# Altium project LimeSDR-Micro_mPCIe_1v3.PrjPcb (part 7 of 10)

## Sheet 10_Clock.SchDoc: Clock
size A3; Organization: Lime Microsystems; Address1: Surrey Tech Centre; Address2: Guildford GU2 7YG; Address3: Surrey; Address4: United Kingdom; Revision: 1.3; SheetNumber: 10; SheetTotal: 11
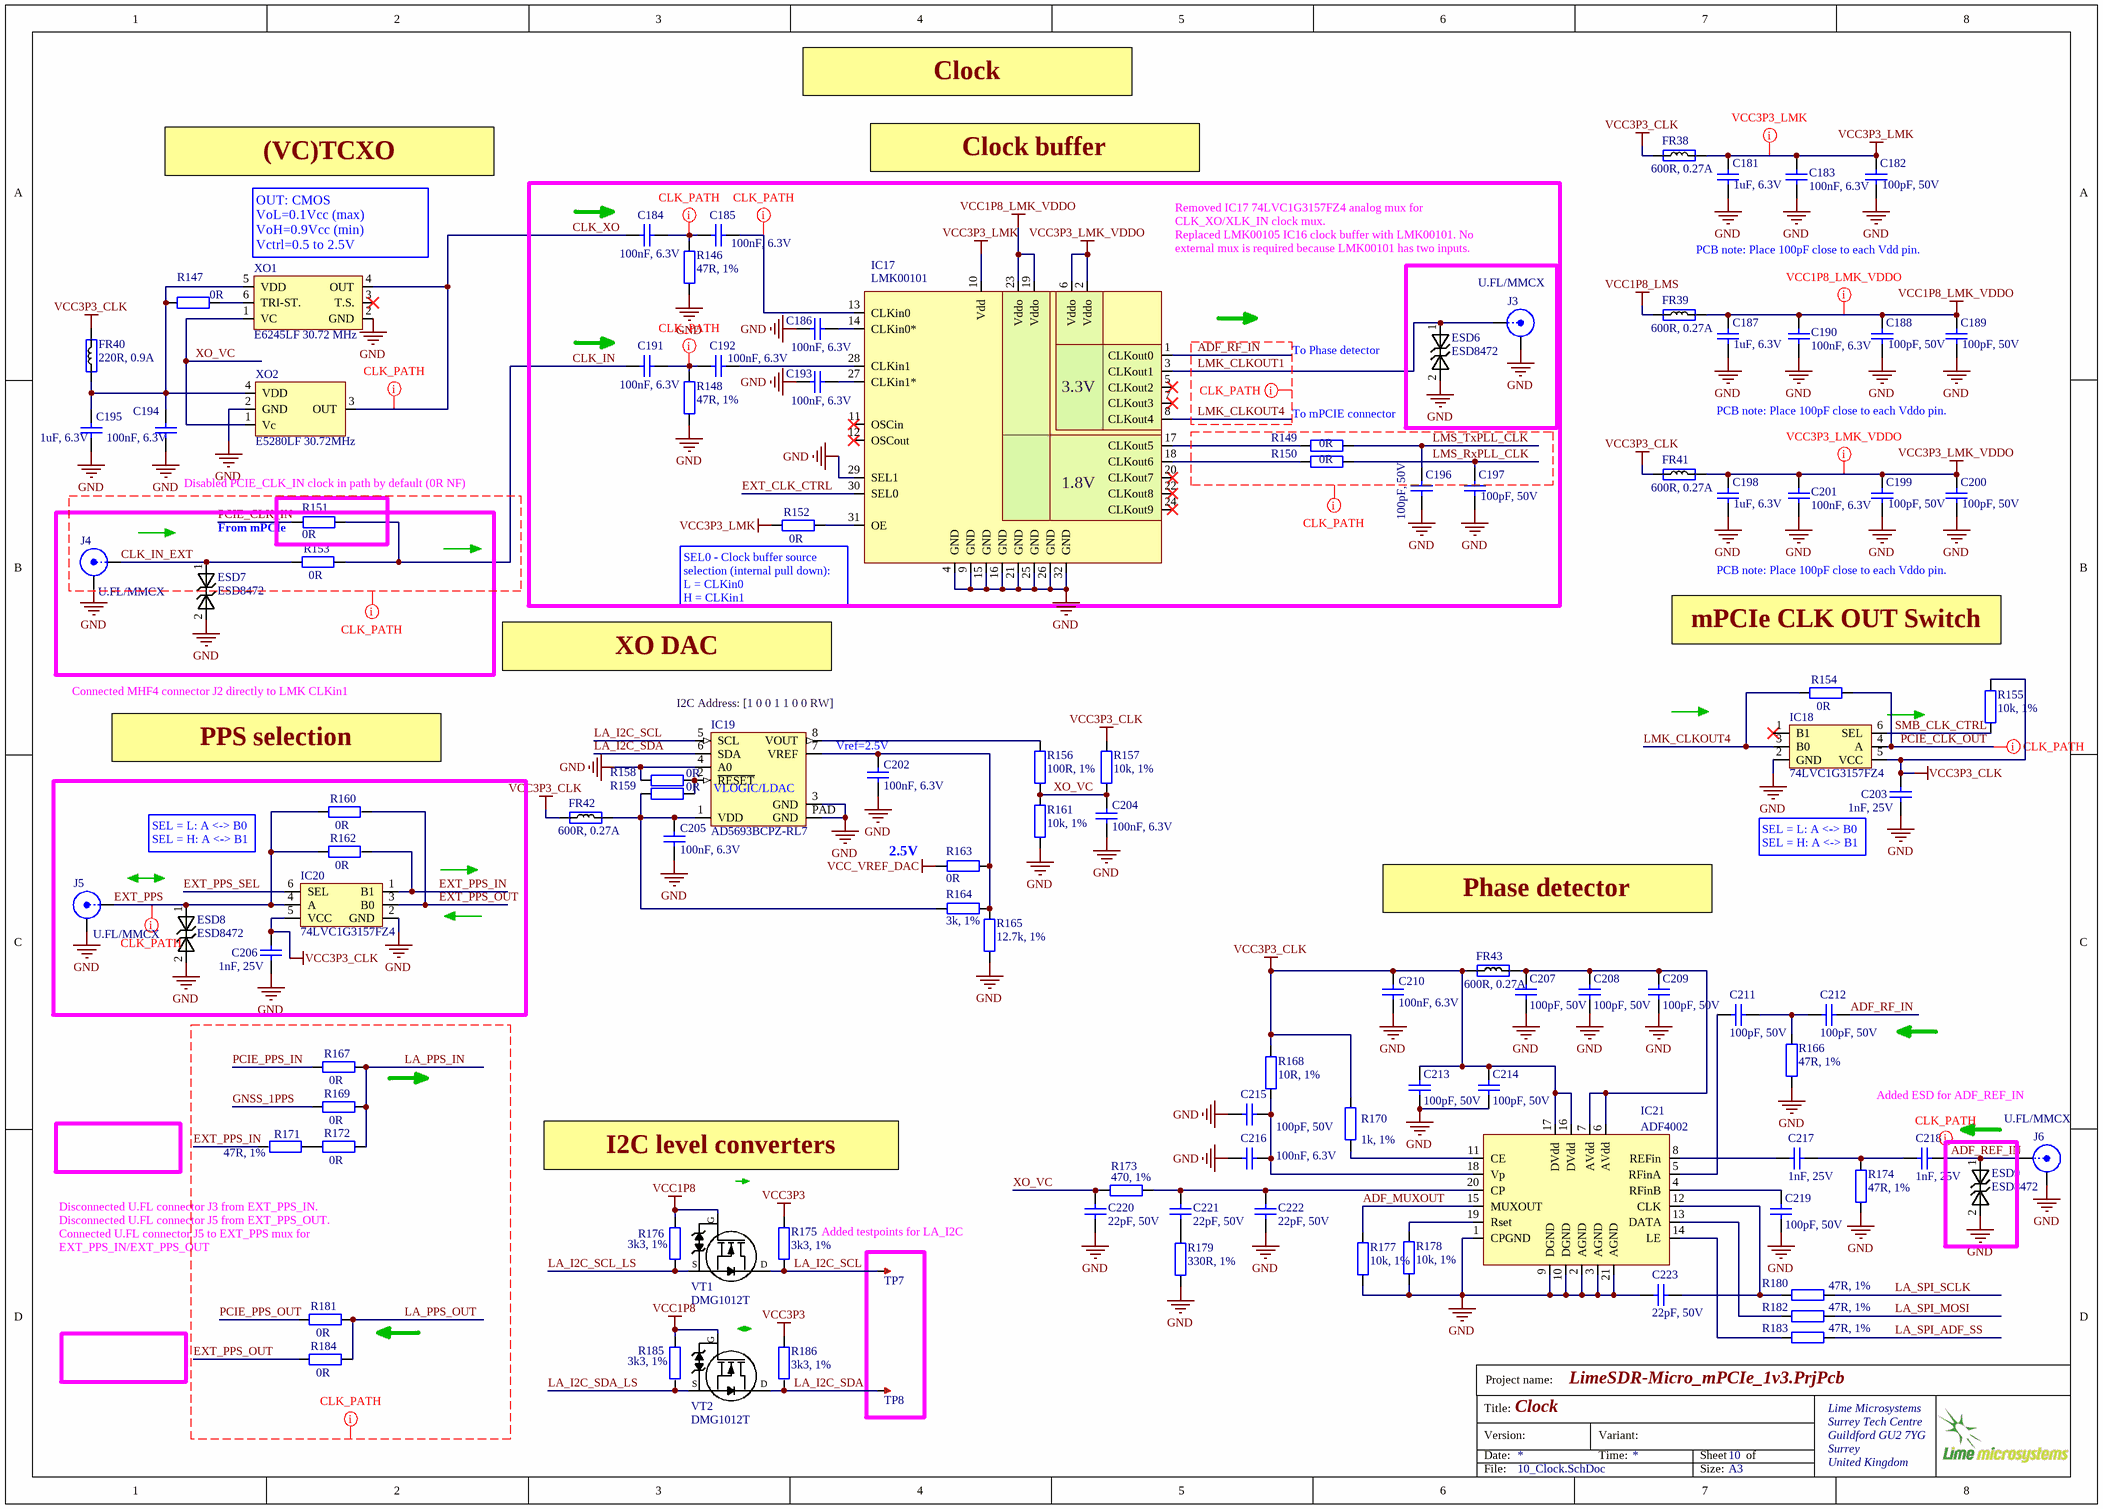
[diagram p9: 10_Clock.SchDoc]

### Parts
C181  1uF, 6.3V  [CAP0201]
C182  100pF, 50V  [CAP0201]
C183  100nF, 6.3V  [CAP0201]
C184  100nF, 6.3V  [CAP0201]
C185  100nF, 6.3V  [CAP0201]
C186  100nF, 6.3V  [CAP0201]
C187  1uF, 6.3V  [CAP0201]
C188  100pF, 50V  [CAP0201]
C189  100pF, 50V  [CAP0201]
C190  100nF, 6.3V  [CAP0201]
C191  100nF, 6.3V  [CAP0201]
C192  100nF, 6.3V  [CAP0201]
C193  100nF, 6.3V  [CAP0201]
C194  100nF, 6.3V  [CAP0201]
C195  1uF, 6.3V  [CAP0201]
C196  100pF, 50V  [CAP0201]
C197  100pF, 50V  [CAP0201]
C198  1uF, 6.3V  [CAP0201]
C199  100pF, 50V  [CAP0201]
C200  100pF, 50V  [CAP0201]
C201  100nF, 6.3V  [CAP0201]
C202  100nF, 6.3V  [CAP0201]
C203  1nF, 25V  [CAP0201]
C204  100nF, 6.3V  [CAP0201]
C205  100nF, 6.3V  [CAP0201]
C206  1nF, 25V  [CAP0201]
C207  100pF, 50V  [CAP0201]
C208  100pF, 50V  [CAP0201]
C209  100pF, 50V  [CAP0201]
C210  100nF, 6.3V  [CAP0201]
C211  100pF, 50V  [CAP0201]
C212  100pF, 50V  [CAP0201]
C213  100pF, 50V  [CAP0201]
C214  100pF, 50V  [CAP0201]
C215  100pF, 50V  [CAP0201]
C216  100nF, 6.3V  [CAP0201]
C217  1nF, 25V  [CAP0201]
C218  1nF, 25V  [CAP0201]
C219  100pF, 50V  [CAP0201]
C220  22pF, 50V  [CAP0201]
C221  22pF, 50V  [CAP0201]
C222  22pF, 50V  [CAP0201]
C223  22pF, 50V  [CAP0201]
ESD6  ESD8472  [ESD8472_X3DFN2]
ESD7  ESD8472  [ESD8472_X3DFN2]
ESD8  ESD8472  [ESD8472_X3DFN2]
ESD9  ESD8472  [ESD8472_X3DFN2]
FR38  600R, 0.27A  [RES0201]
FR39  600R, 0.27A  [RES0201]
FR40  220R, 0.9A  [RES0402]
FR41  600R, 0.27A  [RES0201]
FR42  600R, 0.27A  [RES0201]
FR43  600R, 0.27A  [RES0201]
IC17  LMK00101  [LMK00101_WQFN32]
IC18  74LVC1G3157FZ4  [74LVC1G3157FZ4_SPDT_SW_DFN1410-6]
IC19  AD5693BCPZ-RL7  [AD5693RACPZ-1RL7_DAC_8LFCSP]
IC20  74LVC1G3157FZ4  [74LVC1G3157FZ4_SPDT_SW_DFN1410-6]
IC21  ADF4002  [ADF4002]
J3  U.FL/MMCX  [MMCX_UFL_conn_u_v2]
J4  U.FL/MMCX  [MMCX_UFL_conn_u_v2]
J5  U.FL/MMCX  [MMCX_UFL_conn_u_v2]
J6  U.FL/MMCX  [MMCX_UFL_conn_u_v2]
R146  47R, 1%  [RES0201]
R147  0R  [RES0402]
R148  47R, 1%  [RES0201]
R149  0R  [RES0201]
R150  0R  [RES0201]
R151  0R  [RES0201]
R152  0R  [RES0201]
R153  0R  [RES0201]
R154  0R  [RES0201]
R155  10k, 1%  [RES0201]
R156  100R, 1%  [RES0201]
R157  10k, 1%  [RES0201]
R158  0R  [RES0201]
R159  0R  [RES0201]
R160  0R  [RES0201]
R161  10k, 1%  [RES0201]
R162  0R  [RES0201]
R163  0R  [RES0201]
R164  3k, 1%  [RES0201]
R165  12.7k, 1%  [RES0201]
R166  47R, 1%  [RES0201]
R167  0R  [RES0201]
R168  10R, 1%  [RES0201]
R169  0R  [RES0201]
R170  1k, 1%  [RES0201]
R171  47R, 1%  [RES0201]
R172  0R  [RES0201]
R173  470, 1%  [RES0201]
R174  47R, 1%  [RES0201]
R175  3k3, 1%  [RES0201]
R176  3k3, 1%  [RES0201]
R177  10k, 1%  [RES0201]
R178  10k, 1%  [RES0201]
R179  330R, 1%  [RES0201]
R180  47R, 1%  [RES0201]
R181  0R  [RES0201]
R182  47R, 1%  [RES0201]
R183  47R, 1%  [RES0201]
R184  0R  [RES0201]
R185  3k3, 1%  [RES0201]
R186  3k3, 1%  [RES0201]
TP7  TESTPOINT_PAD  [TP_PAD_1MM]  (value not drawn)  (no BOM)
TP8  TESTPOINT_PAD  [TP_PAD_1MM]  (value not drawn)  (no BOM)
VT1  DMG1012T  [SOT523]
VT2  DMG1012T  [SOT523]
XO1  E6245LF 30.72 MHz  [RAKON_RPT7050A]
XO2  E5280LF 30.72MHz  [RAKON_TXCO]

### Blocks framed on the sheet
From mPCIe: ESD7 J4 R151 R153

### Nets
GND: C181.2 C182.1 C183.1 C186.1 C187.2 C188.1 C189.1 C190.1 C193.1 C194.2 C195.2 C196.1 C197.1 C198.2 C199.1 C200.1 C201.1 C202.2 C203.1 C204.2 C205.2 C206.1 C207.1 C208.1 C209.1 C210.2 C213.1 C214.1 C215.2 C216.1 C219.1 C220.1 C222.1 C223.2 ESD6.2 ESD7.2 ESD8.2 ESD9.2 IC17.4(GND) IC17.9(GND) IC17.15(GND) IC17.16(GND) IC17.21(GND) IC17.25(GND) IC17.26(GND) IC17.29(SEL1) IC17.32(GND) IC18.2(GND) IC19.3(GND) IC19.4(A0) IC19.PAD(GND) IC20.2(GND) IC21.1(CPGND) IC21.2(AGND) IC21.3(AGND) IC21.9(DGND) IC21.10(DGND) IC21.21(AGND) J3.2(Y) J4.2(Y) J5.2(Y) J6.2(Y) R146.2 R148.2 R158.1 R161.2 R165.2 R166.2 R174.1 R177.2 R178.2 R179.2 XO1.2(GND) XO2.2(GND)
VCC1P8: R176.1 R185.1 VT1.G VT2.G
VCC1P8_LMK_VDDO: C187.1 C188.2 C189.2 C190.2 FR39.2 IC17.19(Vddo) IC17.23(Vddo)
VCC1P8_LMS: FR39.1
VCC3P3: R175.1 R186.1
VCC3P3_CLK: C203.2 C206.2 C210.1 C213.2 C214.2 FR38.1 FR40.2 FR41.1 FR42.1 FR43.1 IC18.5(VCC) IC20.5(VCC) IC21.16(DVdd) IC21.17(DVdd) R155.2 R157.1 R168.2 R170.1
VCC3P3_LMK: C181.1 C182.2 C183.2 FR38.2 IC17.10(Vdd) R152.1
VCC3P3_LMK_VDDO: C198.1 C199.2 C200.2 C201.2 FR41.2 IC17.2(Vddo) IC17.6(Vddo)
VCC_VREF_DAC: R163.2
ADF_MUXOUT: IC21.15(MUXOUT) R177.1
ADF_REF_IN: C218.2 ESD9.1 J6.1(X)
ADF_RF_IN: C212.1 IC17.1(CLKout0)
CLK_IN: C191.2 R151.1 R153.2
CLK_IN_EXT: ESD7.1 J4.1(X) R153.1
CLK_XO: C184.2 XO1.4(OUT) XO2.3(OUT)
EXT_CLK_CTRL: IC17.30(SEL0)
EXT_PPS: ESD8.1 IC20.4(A) J5.1(X) R160.1 R162.1
EXT_PPS_IN: IC20.1(B1) R162.2 R171.2
EXT_PPS_OUT: IC20.3(B0) R160.2 R184.1
EXT_PPS_SEL: IC20.6(SEL)
GNSS_1PPS: R169.1
LA_I2C_SCL: IC19.5(SCL) R175.2 TP7.1 VT1.D
LA_I2C_SCL_LS: R176.2 VT1.S
LA_I2C_SDA: IC19.6(SDA) R186.2 TP8.1 VT2.D
LA_I2C_SDA_LS: R185.2 VT2.S
LA_PPS_IN: R167.2 R169.2 R172.2
LA_PPS_OUT: R181.2 R184.2
LA_SPI_ADF_SS: R183.2
LA_SPI_MOSI: R182.2
LA_SPI_SCLK: R180.2
LMK_CLKOUT1: ESD6.1 IC17.3(CLKout1) J3.1(X)
LMK_CLKOUT4: IC17.8(CLKout4) IC18.3(B0) R154.1
LMS_RxPLL_CLK: C197.2 R150.2
LMS_TxPLL_CLK: C196.2 R149.2
PCIE_CLK_IN: R151.2
PCIE_CLK_OUT: IC18.4(A) R154.2
PCIE_PPS_IN: R167.1
PCIE_PPS_OUT: R181.1
SMB_CLK_CTRL: IC18.6(SEL) R155.1
XO_VC: C204.1 C220.2 R156.2 R157.2 R161.1 R173.1 XO1.1(VC) XO2.1(Vc)
NetC184_1: C184.1 C185.1 R146.1
NetC185_2: C185.2 IC17.13(CLKin0)
NetC186_2: C186.2 IC17.14(CLKin0*)
NetC191_1: C191.1 C192.1 R148.1
NetC192_2: C192.2 IC17.28(CLKin1)
NetC193_2: C193.2 IC17.27(CLKin1*)
NetC194_1: C194.1 C195.1 FR40.1 R147.2 XO1.5(VDD) XO2.4(VDD)
NetC202_1: C202.1 IC19.7(VREF) R163.1 R164.1 R165.1
NetC205_1: C205.1 FR42.2 IC19.1(VDD) R159.1 R164.2
NetC207_2: C207.2 C208.2 C209.2 FR43.2 IC21.6(AVdd) IC21.7(AVdd)
NetC211_1: C211.1 C212.2 R166.1
NetC211_2: C211.2 IC21.5(RFinA)
NetC215_1: C215.1 C216.2 IC21.18(Vp) R168.1
NetC217_1: C217.1 IC21.8(REFin)
NetC217_2: C217.2 C218.1 R174.2
NetC219_2: C219.2 IC21.4(RFinB)
NetC221_1: C221.1 R179.1
NetC221_2: C221.2 C222.2 IC21.20(CP) R173.2
NetC223_1: C223.1 IC21.12(CLK) R180.1
NetIC17_17: IC17.17(CLKout5) R149.1
NetIC17_18: IC17.18(CLKout6) R150.1
NetIC17_31: IC17.31(OE) R152.2
NetIC19_2: IC19.2(~{RESET}) R158.2 R159.2
NetIC19_8: IC19.8(VOUT) R156.1
NetIC21_11: IC21.11(CE) R170.2
NetIC21_13: IC21.13(DATA) R182.1
NetIC21_14: IC21.14(LE) R183.1
NetIC21_19: IC21.19(Rset) R178.1
NetR147_1: R147.1 XO1.6(TRI-ST.)
NetR171_1: R171.1 R172.1

Not connected (* = marked no-connect by the designer): IC17 5(CLKout2)* 7(CLKout3)* 11(OSCin)* 12(OSCout)* 20(CLKout7)* 22(CLKout8)* 24(CLKout9)*; IC18 1(B1)*; XO1 3(T.S.)*

### Layout directives
net class CLK_PATH: ADF_REF_IN, ADF_RF_IN, CLK_IN_EXT, CLK_XO, EXT_PPS, EXT_PPS_IN, EXT_PPS_OUT, GND, GNSS_1PPS, LA_PPS_IN, LA_PPS_OUT, LMK_CLKOUT1, LMK_CLKOUT4, LMS_RxPLL_CLK, LMS_TxPLL_CLK, NetC184_1, NetC185_2, NetC191_1, PCIE_CLK_IN, PCIE_CLK_OUT, PCIE_PPS_IN, PCIE_PPS_OUT
net class VCC3P3_LMK: VCC3P3_LMK
net class VCC3P3_LMKRF: VCC1P8_LMK_VDDO
net class VCC3P3_LMK_VDDO: VCC3P3_LMK_VDDO

### Notes on the sheet
- Clock
- (VC)TCXO
- Clock buffer
- (near XO1) OUT: CMOS
  VoL=0.1Vcc (max)
  VoH=0.9Vcc (min)
  Vctrl=0.5 to 2.5V
- (near IC17) Removed IC17 74LVC1G3157FZ4 analog mux for CLK_XO/XLK_IN clock mux.
  Replaced LMK00105 IC16 clock buffer with LMK00101. No external mux is required because LMK00101 has two inputs.
  Connected U.FL connector J3 directly to LMK_CLKOUT1
- PCB note: Place 100pF close to each Vdd pin.
- (near ESD6) To Phase detector
- (near IC17) 3.3V
- To mPCIE connector
- PCB note: Place 100pF close to each Vddo pin.
- (near IC17) 1.8V
- (near R151) Disabled PCIE_CLK_IN clock in path by default (0R NF)
- SEL0 - Clock buffer source selection (internal pull down):
  L = CLKin0
  H = CLKin1
- mPCIe CLK OUT Switch
- XO DAC
- (near IC19) I2C Address: [1 0 0 1 1 0 0 RW]
- Connected MHF4 connector J2 directly to LMK CLKin1
- (near R160) PPS selection
- (near C202) Vref=2.5V
- SEL = L: A <-> B0
  SEL = H: A <-> B1
- (near IC19) VLOGIC/LDAC
- (near R163) 2.5V
- Phase detector
- I2C level converters
- Added ESD for ADF_REF_IN
- Disconnected U.FL connector J3 from EXT_PPS_IN.
  Disconnected U.FL connector J5 from EXT_PPS_OUT.
  Connected U.FL connector J5 to EXT_PPS mux for
  EXT_PPS_IN/EXT_PPS_OUT
- (near TP7) Added testpoints for LA_I2C
- Project name:
- Title:
- Version:
- Date:
- Variant:
- Time:
- Sheet
- of
- File:
- Size:
- A3

### Library data of the parts
C181 C187 C195 C198 = Cap_0402: Manufacturer: TDK Corporation; Manufacturer Part Number 1: JMK063ABJ105MP-F; Part Description: 1µF ±20% 6.3V X5R Ceramic Capacitor -55°C ~ 85°C Surface Mount, MLCC 0201 (0603 Metric) 0.024" L x 0.012" W (0.60mm x 0.30mm); Value: 1uF, 20%; Tolerance: ±20%; Capacitance: 1.0µF; Temperature Coefficient: X5R; Supplier 1: Digi-Key; Supplier Part Number 1: 587-5864-2-ND; Applications: General Purpose; Features: -; Lead Style: -; Ratings: -; Thickness (Max): -; Lead Spacing: -; Height - Seated (Max): -; Size / Dimension: 0.024" L x 0.012" W (0.60mm x 0.30mm); Mounting Type: Surface Mount, MLCC; Operating Temperature: -55°C ~ 85°C; Package / Case: 0201 (0603 Metric); Packaging: Cut Tape (CT); Voltage - Rated: 6.3V; Category: Capacitors; RoHS: RoHS Compliant
C182 C188 C189 C196 C197 C199 C200 = Cap_0402: Part Description: 100 pF ±5% 50V Ceramic Capacitor C0G, NP0 0201 (0603 Metric); Manufacturer: TDK; Manufacturer Part Number 1: C0603C0G1H101J030BA; Dielectric Material: Ceramic; Tolerance: 5%; Dielectric: C0G; Insulation Resistance: 10GR; Value: 100pF, 50V; Supplier 1: Digi-Key; Supplier Part Number 1: 445-1786-1-ND; Stock 1: 367528; Pricing 1: 1=0,10000, 10=0,06000, 50=0,03280, 100=0,02670, 500=0,01908, 1000=0,01500, 2500=0,01364, 5000=0,01254 (USD); RoHS: Yes; Mount: Surface Mount; Case/Package: 0201; Number of Pins: 2; Case Code (Metric): 0603; Case Code (Imperial): 0201; Weight: 6E-06oz; Min Operating Temperature: -55°C; Max Operating Temperature: 125°C; Package Quantity: 1; Capacitance: 100pF; Voltage Rating: 50V; Packaging: Tape and Reel; Voltage Rating (DC): 50V; Termination: SMD/SMT; Voltage: 50V; Series: C; Construction: Flat; Length: 0.6mm; Width: 0.012inch; Height: 0.3mm; Thickness: 0.013inch; Depth: 0.3mm; Reach SVHC Compliant: Yes; Lead Free: Lead Free; RoHS Compliant: Yes; ComponentLink1URL: https://datasheet.ciiva.com/24217/c0603c0g1h101j030ba-264106-24217425.pdf?src-supplier=Mouser; ComponentLink1Description: https://datasheet.ciiva.com/24217/c0603c0g1h101j030ba-264106-24217425.pdf?src-supplier=Mouser; ComponentLink2URL: https://datasheet.ciiva.com/16205/mlcc-commercial-general-en-16205590.pdf?src-supplier=Future+Electronics; ComponentLink2Description: https://datasheet.ciiva.com/16205/mlcc-commercial-general-en-16205590.pdf?src-supplier=Future+Electronics; ComponentLink3URL: https://datasheet.ciiva.com/6250/tdkmlcccaprange-6250351.pdf?src-supplier=Digi-Key; ComponentLink3Description: https://datasheet.ciiva.com/6250/tdkmlcccaprange-6250351.pdf?src-supplier=Digi-Key
C183-C186 C190-C194 C201 C202 C204 C205 C210 C216 = Cap_0402: Part Description: 0.1 µF ±20% 10V Ceramic Capacitor X5R 0201 (0603 Metric); Manufacturer: Samsung; Manufacturer Part Number 1: CL03A104MP3NNNC; Tolerance: 20%; Voltage Rating (DC): 10V; Value: 100nF, 6.3V; Capacitance: 100nF; Case/Package: 0201; Case Code (Imperial): 0201; Case Code (Metric): 0603; ComponentLink5Description: https://datasheet.ciiva.com/25788/cl03a104mp3nnnc-25788272.pdf?src-supplier=Digi-Key; ComponentLink5URL: https://datasheet.ciiva.com/25788/cl03a104mp3nnnc-25788272.pdf?src-supplier=Digi-Key; Length: 0.024inch; Max Operating Temperature: 85°C; Min Operating Temperature: -55°C; Mount: Surface Mount; Package Quantity: 1; Packaging: Tape and Reel; Pricing 1: 1=0,10000, 10=0,03000, 50=0,01640, 100=0,01330, 500=0,00950, 1000=0,00747, 2500=0,00679, 5000=0,00625 (USD); RoHS: Yes; RoHS Compliant: Yes; Series: CL; Stock 1: 3817176; Supplier 1: Digi-Key; Supplier Part Number 1: 1276-1321-1-ND; Thickness: 0.013inch; Voltage Rating: 10V; Width: 0.012inch
C203 C206 C217 C218 = Cap_0402: Manufacturer Part Number 1: C0603X7R1E102K030BA; Manufacturer: TDK Corporation; Part Description: 1000pF ±10% 25V X7R Ceramic Capacitor -55°C ~ 125°C Surface Mount, MLCC 0201 (0603 Metric) 0.024" L x 0.012" W (0.60mm x 0.30mm); Temperature Coefficient: X7R; Tolerance: ±10%; Capacitance: 1000pF; Value: 1nF, 25V; Supplier 1: Digi-Key; Supplier Part Number 1: 445-7275-1-ND; Voltage - Rated: 25V; Features: -; Package / Case: 0201 (0603 Metric); Lead Spacing: -; Mounting Type: Surface Mount, MLCC; Lead Style: -; Height - Seated (Max): -; Operating Temperature: -55°C ~ 125°C; Size / Dimension: 0.024" L x 0.012" W (0.60mm x 0.30mm); Applications: General Purpose; Ratings: -; Thickness (Max): 0.013" (0.33mm); RoHS: RoHS Compliant; Packaging: Cut Tape (CT); Category: Capacitors
C207-C209 C211-C215 C219 = Cap_0402: Part Description: 100 pF ±5% 50V Ceramic Capacitor C0G, NP0 0201 (0603 Metric); Manufacturer: TDK; Manufacturer Part Number 1: C0603C0G1H101J030BA; Dielectric: C0G; Dielectric Material: Ceramic; Insulation Resistance: 10GR; Tolerance: 5%; Value: 100pF, 50V; Capacitance: 100pF; Case/Package: 0201; Case Code (Imperial): 0201; Case Code (Metric): 0603; ComponentLink1Description: https://datasheet.ciiva.com/24217/c0603c0g1h101j030ba-264106-24217425.pdf?src-supplier=Mouser; ComponentLink1URL: https://datasheet.ciiva.com/24217/c0603c0g1h101j030ba-264106-24217425.pdf?src-supplier=Mouser; ComponentLink2Description: https://datasheet.ciiva.com/16205/mlcc-commercial-general-en-16205590.pdf?src-supplier=Future+Electronics; ComponentLink2URL: https://datasheet.ciiva.com/16205/mlcc-commercial-general-en-16205590.pdf?src-supplier=Future+Electronics; ComponentLink3Description: https://datasheet.ciiva.com/6250/tdkmlcccaprange-6250351.pdf?src-supplier=Digi-Key; ComponentLink3URL: https://datasheet.ciiva.com/6250/tdkmlcccaprange-6250351.pdf?src-supplier=Digi-Key; Construction: Flat; Depth: 0.3mm; Height: 0.3mm; Lead Free: Lead Free; Length: 0.6mm; Max Operating Temperature: 125°C; Min Operating Temperature: -55°C; Mount: Surface Mount; Number of Pins: 2; Package Quantity: 1; Packaging: Tape and Reel; Pricing 1: 1=0,10000, 10=0,06000, 50=0,03280, 100=0,02670, 500=0,01908, 1000=0,01500, 2500=0,01364, 5000=0,01254 (USD); Reach SVHC Compliant: Yes; RoHS: Yes; RoHS Compliant: Yes; Series: C; Stock 1: 367528; Supplier 1: Digi-Key; Supplier Part Number 1: 445-1786-1-ND; Termination: SMD/SMT; Thickness: 0.013inch; Voltage: 50V; Voltage Rating (DC): 50V; Voltage Rating: 50V; Weight: 6E-06oz; Width: 0.012inch
C220-C223 = Cap_0402: as C167-C169 on sheet 09_Misc; Value: 22pF, 50V; Supplier 1: Digi-Key; Supplier Part Number 1: 490-6123-1-ND; Stock 1: 2966748; Pricing 1: 1=0,10000, 10=0,01300, 50=0,00720, 100=0,00590, 500=0,00424, 1000=0,00333, 2500=0,00303, 5000=0,00279 (USD); RoHS: Yes; Mount: Surface Mount; Case/Package: 0201; Case Code (Metric): 0603; Case Code (Imperial): 0201; Min Operating Temperature: -55°C; Max Operating Temperature: 125°C; Package Quantity: 15000; Capacitance: 22pF; Voltage Rating: 50V; Packaging: Tape and Reel; Termination: SMD/SMT; Voltage: 50V; Voltage Rating (DC): 50V; Series: GRM; Length: 0.6mm; Width: 0.012inch; Height: 0.3mm; Thickness: 0.013inch; Depth: 0.3mm; Lead Free: Lead Free; RoHS Compliant: Yes; ComponentLink1URL: https://datasheet.ciiva.com/6271/partnumbering-e-01-6271146.pdf?src-supplier=Digi-Key; ComponentLink1Description: https://datasheet.ciiva.com/6271/partnumbering-e-01-6271146.pdf?src-supplier=Digi-Key; ComponentLink2URL: https://datasheet.ciiva.com/6271/partnumbering-e-01-6271143.pdf?src-supplier=Digi-Key; ComponentLink2Description: https://datasheet.ciiva.com/6271/partnumbering-e-01-6271143.pdf?src-supplier=Digi-Key; ComponentLink3URL: https://datasheet.ciiva.com/6271/partnumbering-e-01-6271149.pdf?src-supplier=Digi-Key; ComponentLink3Description: https://datasheet.ciiva.com/6271/partnumbering-e-01-6271149.pdf?src-supplier=Digi-Key
ESD6-ESD9 = ESD8472: Manufacturer: ON Semiconductor; Manufacturer Part Number 1: ESD8472MUT5G; Part Description: TVS DIODE 5.3VWM 14VC X3DFN2; Voltage - Reverse Standoff (Typ): 5.3V (Max); Voltage - Breakdown (Min): 7V; Voltage - Clamping (Max) @ Ipp: 14V; Current - Peak Pulse (10/1000µs): 3A (8/20µs); Power Line Protection: No; Capacitance @ Frequency: 0.2pF @ 1MHz; Supplier 1: Digi-Key; RoHS: RoHS Compliant; Category: Circuit Protection; Stock 1: 2295; Pricing 1: 1=0.39, 10=0.315, 100=0.2142, 500=0.16068, 1000=0.12051 (USD); Packaging: Cut Tape (CT); Part Status: Active; Type: Zener; Power - Peak Pulse: -; Applications: Automotive, RF Antenna; Operating Temperature: -55°C ~ 150°C (TJ); Mounting Type: Surface Mount; Package / Case: 2-XFDFN; Supplier Device Package: 2-X3DFN (0.62x0.32); ComponentLink1URL: http://www.onsemi.com/pub/Collateral/ESD8472-D.PDF; ComponentLink1Description: http://www.onsemi.com/pub/Collateral/ESD8472-D.PDF; Supplier Part Number 1: ESD8472MUT5GOSCT-ND
FR38 FR39 FR41-FR43 = Ferrite: Manufacturer Part Number 1: BK0603TS601-T; Manufacturer: Taiyo Yuden; Part Description: FERRITE BEAD 600 OHM 0201 1LN; DC Resistance (DCR): 750 mOhm Max; Filter Type: Differential Mode - Single; Impedance @ Frequency: 600 Ohm @ 100MHz; Current Rating: 270mA; Value: 600R@100MHz; Supplier 1: Digi-Key; Supplier Part Number 1: 587-3277-1-ND; Size / Dimension: 0.024" L x 0.012" W (0.60mm x 0.30mm); Package / Case: 0201 (0603 Metric); Height (Max): 0.013" (0.33mm); Mounting Type: Surface Mount; Packaging: Cut Tape (CT); RoHS: RoHS Compliant; Category: Filters
FR40 = Ferrite: Manufacturer: TDK Corporation; Manufacturer Part Number 1: MPZ1005S221ET000; Part Description: FERRITE BEAD 220 OHM 0402 1LN; Impedance @ Frequency: 220 Ohm @ 100MHz; Current Rating: 900mA; DC Resistance (DCR): 220 mOhm Max; Supplier 1: Digi-Key; Package / Case: 0402 (1005 Metric); Category: Filters; Supplier Part Number 1: 445-9329-2-ND; Value: 220R, 0.9A
IC17 = LMK00101: Manufacturer: Texas Instruments; Manufacturer Part Number 1: LMK00101SQE/NOPB; Part Description: Clock Fanout Buffer (Distribution), Multiplexer, Translator IC 200MHz 32-WFQFN Exposed Pad; Input: HCSL, LVCMOS, LVDS, LVPECL, LVTTL, SSTL, Crystal; Frequency - Max: 200MHz; Output: LVCMOS, LVTTL; Ratio - Input:Output: 3:10; Number of Circuits: 1; Voltage - Supply: 2.375 V ~ 3.45 V; Differential - Input:Output: Yes/No; Supplier 1: Digi-Key; Mounting Type: Surface Mount; Package / Case: 32-WFQFN Exposed Pad; RoHS: RoHS Compliant; Operating Temperature: -40°C ~ 85°C; Type: Fanout Buffer (Distribution), Multiplexer, Translator; Category: Integrated Circuits (ICs); Packaging: Cut Tape (CT); Supplier Device Package: 32-WQFN (5x5); Supplier Part Number 1: 296-39036-1-ND
IC18 IC20 = 74LVC1G3157FZ4_SPDT_SW: Part Description: 1 Circuit IC Switch 2:1 10Ohm X2-DFN1410-6; Manufacturer: Diodes; Manufacturer Part Number 1: 74LVC1G3157FZ4-7; Number of Circuits: 1; On-State Resistance: 10R; -3db Bandwidth: 300MHz; Supplier 1: Digi-Key; Supplier Part Number 1: 74LVC1G3157FZ4-7DICT-ND; Stock 1: 158709; Pricing 1: 1=0,42000, 10=0,31200, 25=0,27320, 100=0,17670, 250=0,14628, 500=0,11702, 1000=0,08972, 2500=0,07802 (USD); RoHS: Yes; Number of Pins: 6; Min Operating Temperature: -40°C; Max Operating Temperature: 125°C; Packaging: Tape and Reel; RoHS Compliant: Yes; ComponentLink1URL: https://www.diodes.com/assets/Datasheets/74LVC1G3157.pdf?src-supplier=Digi-Key; ComponentLink1Description: https://www.diodes.com/assets/Datasheets/74LVC1G3157.pdf?src-supplier=Digi-Key; ComponentLink2URL: https://www.diodes.com/assets/product-showcases/74LVC3157-NPA-0516.pdf?src-supplier=Digi-Key; ComponentLink2Description: https://www.diodes.com/assets/product-showcases/74LVC3157-NPA-0516.pdf?src-supplier=Digi-Key
IC19 = AD5693RACPZ-1RL7_DAC: Part Description: 16 Bit Digital to Analog Converter 1 8-LFCSP-UD (2x2); Manufacturer: Analog Devices; Supplier 1: Digikey; Supplier Part Number 1: 505-AD5693BCPZ-RL7CT-ND; Manufacturer Part Number 1: AD5693BCPZ-RL7; Stock 1: 5532; Pricing 1: 1=9,21, 10=6,366, 25=5,6328, 100=4,8123, 250=4,41452, 500=4,17228, 1000=3,97118 (USD); RoHS: Yes; ComponentLink1URL: http://www.mouser.com/ds/2/609/AD5693R_5692R_5691R_5693-534178.pdf?src-supplier=Mouser; ComponentLink1Description: http://www.mouser.com/ds/2/609/AD5693R_5692R_5691R_5693-534178.pdf?src-supplier=Mouser; ComponentLink2URL: https://www.analog.com/media/en/technical-documentation/data-sheets/AD5693R_5692R_5691R_5693.pdf?src-supplier=Digi-Key; ComponentLink2Description: https://www.analog.com/media/en/technical-documentation/data-sheets/AD5693R_5692R_5691R_5693.pdf?src-supplier=Digi-Key; ComponentLink3URL: http://www.analog.com/static/imported-files/data_sheets/AD5693R_5692R_5691R.pdf?src-supplier=Avnet; ComponentLink3Description: http://www.analog.com/static/imported-files/data_sheets/AD5693R_5692R_5691R.pdf?src-supplier=Avnet; ComponentLink4URL: http://www.analog.com/media/en/technical-documentation/data-sheets/AD5693R_5692R_5691R_5693.pdf?src-supplier=Digi-Key; ComponentLink4Description: http://www.analog.com/media/en/technical-documentation/data-sheets/AD5693R_5692R_5691R_5693.pdf?src-supplier=Digi-Key; ComponentLink5Description: https://www.analog.com/media/en/technical-documentation/data-sheets/AD5693R_5692R_5691R_5693.pdf?src-supplier=Digikey; ComponentLink5URL: https://www.analog.com/media/en/technical-documentation/data-sheets/AD5693R_5692R_5691R_5693.pdf?src-supplier=Digikey; ComponentLink6Description: http://www.analog.com/media/en/technical-documentation/data-sheets/AD5693R_5692R_5691R_5693.pdf?src-supplier=Digikey; ComponentLink6URL: http://www.analog.com/media/en/technical-documentation/data-sheets/AD5693R_5692R_5691R_5693.pdf?src-supplier=Digikey; ComponentLink7Description: http://www.analog.com/static/imported-files/data_sheets/AD5693R_5692R_5691R_5693.pdf?src-supplier=Avnet; ComponentLink7URL: http://www.analog.com/static/imported-files/data_sheets/AD5693R_5692R_5691R_5693.pdf?src-supplier=Avnet; ComponentLink8Description: http://www.farnell.com/datasheets/1863077.pdf?src-supplier=Element14; ComponentLink8URL: http://www.farnell.com/datasheets/1863077.pdf?src-supplier=Element14; ComponentLink9Description: https://datasheet.octopart.com/AD5693BCPZ-RL7-Analog-Devices-datasheet-79096046.pdf?src-supplier=Element14; ComponentLink9URL: https://datasheet.octopart.com/AD5693BCPZ-RL7-Analog-Devices-datasheet-79096046.pdf?src-supplier=Element14
IC21 = ADF4002: Manufacturer: Analog Devices Inc; Manufacturer Part Number 1: ADF4002BCPZ-RL7; Part Description: IC PLL FREQUENCY SYNTH 20-LFCSP; Ratio - Input:Output: 2:1; Differential - Input:Output: Yes/No; Input: CMOS, TTL; Voltage - Supply: 2.7 V ~ 3.3 V; Supplier 1: Digi-Key; Supplier: Digi-Key; Category: Integrated Circuits (ICs); Type: Clock/Frequency Synthesizer (RF), Phase Detector; Operating Temperature: -40°C ~ 85°C; Mounting Type: Surface Mount; Package / Case: 20-VFQFN Exposed Pad, CSP; Supplier Part Number 1: ADF4002BCPZ-RL7CT-ND
J3 J6 = RF_IF_connector: CONN UMC RCPT STR 50 OHM SMD; Manufacturer: Molex, LLC; Manufacturer Part Number 1: 0734120110; Body Finish: Nickel; Body Material: Phosphor Bronze; Center Contact Material: Brass; Center Contact Plating: Gold; Connector Style: Ultra Miniature Coaxial; Connector Type: Jack, Male Pin; Contact Termination: Solder; Dielectric Material: Liquid Crystal Polymer (LCP); Frequency - Max: 6GHz; Impedance: 50 Ohm; Voltage Rating: 60V; Cable Group: -; Category: Connectors, Interconnects; Fastening Type: Snap-On; Features: -; Housing Color: Silver; Ingress Protection: -; Mounting Type: Surface Mount; Operating Temperature: -40°C ~ 90°C; Packaging: Cut Tape (CT); RoHS: RoHS Compliant; Shield Termination: Solder; Supplier 1: Digi-Key; Supplier Part Number 1: WM5587CT-ND; Part Description: CONN UMC RCPT STR 50 OHM SMD
J4 J5 = RF_IF_connector: CONN UMC RCPT STR 50 OHM SMD; Manufacturer: Molex, LLC; Manufacturer Part Number 1: 0734120110; Part Description: Ultra Miniature Coaxial Connector Receptacle, Male Pin 50 Ohm Surface Mount Solder; Body Finish: Nickel; Body Material: Phosphor Bronze; Center Contact Material: Brass; Center Contact Plating: Gold; Connector Style: Ultra Miniature Coaxial; Connector Type: Jack, Male Pin; Contact Termination: Solder; Dielectric Material: Liquid Crystal Polymer (LCP); Frequency - Max: 6GHz; Impedance: 50 Ohm; Voltage Rating: 60V; Cable Group: -; Category: Connectors, Interconnects; Fastening Type: Snap-On; Features: -; Housing Color: Silver; Ingress Protection: -; Mounting Type: Surface Mount; Operating Temperature: -40°C ~ 90°C; Packaging: Cut Tape (CT); RoHS: RoHS Compliant; Shield Termination: Solder; Supplier 1: Digi-Key; Supplier Part Number 1: WM5587CT-ND
R146 R148 R166 R171 R174 R180 R182 R183 = Res_0402: Manufacturer: Yageo; Manufacturer Part Number 1: RC0201FR-0747RL; Part Description: 47 Ohms ±1% 0.05W, 1/20W Chip Resistor 0201 (0603 Metric) Moisture Resistant Thick Film; Power Rating: 50mW; Voltage Rating: 25V; Temperature Coefficient: 200ppm/°C; Value: 47R, 1%; Supplier 1: Digi-Key; Supplier Part Number 1: YAG2694CT-ND; Stock 1: 778022; Pricing 1: 1=0,10000, 10=0,03700, 100=0,01530, 1000=0,00685, 2500=0,00595, 5000=0,00491 (USD); RoHS: Yes; Case/Package: 0201; Case Code (Imperial): 0201; Case Code (Metric): 0603; Min Operating Temperature: -55°C; Max Operating Temperature: 125°C; Packaging: Tape and Reel; Resistance: 47R; Tolerance: 1%; Resistor Type: Thick Film; Termination: SMD/SMT; Number of Terminations: 2; Max Power Dissipation: 50mW; Features: Moisture Resistant; Series: RC; Resistance Tolerance: 1%; Length: 0.6mm; Width: 0.3mm; Height: 0.23mm; Reach SVHC Compliant: Yes; RoHS Compliant: Yes; ComponentLink1URL: https://datasheet.ciiva.com/5924/1563626-5924912.pdf?src-supplier=Farnell; ComponentLink1Description: https://datasheet.ciiva.com/5924/1563626-5924912.pdf?src-supplier=Farnell; ComponentLink2URL: https://datasheet.ciiva.com/22661/1563626-22661319.pdf?src-supplier=Element14; ComponentLink2Description: https://datasheet.ciiva.com/22661/1563626-22661319.pdf?src-supplier=Element14
R147 = Res_0402: Manufacturer Part Number 1: RC0402JR-070RL; Manufacturer: Yageo; Part Description: RES SMD 0.0OHM JUMPER 1/16W 0402; Resistance (Ohms): 0.0; Tolerance: Jumper; Power (Watts): 0.063W, 1/16W; Value: 0R; Supplier 1: Digi-Key; Supplier Part Number 1: 311-0.0JRTR-ND; Category: Resistors; Temperature Coefficient: -; Features: Moisture Resistant; Supplier Device Package: 0402; Height: 0.016" (0.40mm); Package / Case: 0402 (1005 Metric); Operating Temperature: -55°C ~ 155°C; Size / Dimension: 0.039" L x 0.020" W (1.00mm x 0.50mm); Composition: Thick Film; Packaging: Tape & Reel (TR); Number of Terminations: 2; RoHS: RoHS Compliant
R149-R154 R158-R160 R162 R167 R169 R172 R181 R184 = Res_0402: Part Description: 0 Ohms Jumper Chip Resistor 0201 (0603 Metric) Moisture Resistant Thick Film; Manufacturer: Yageo; Manufacturer Part Number 1: RC0201JR-070RL; Power Rating: 50mW; Tolerance: 5%; Voltage Rating: 25V; ComponentLink1URL: http://www.yageo.com/documents/recent/PYu-RC_Group_51_RoHS_L_7.pdf; ComponentLink1Description: http://www.yageo.com/documents/recent/PYu-RC_Group_51_RoHS_L_7.pdf; Value: 0R; Supplier 1: Digi-Key; Supplier Part Number 1: 311-0.0NCT-ND; Stock 1: 6252381; Pricing 1: 1=0,10000, 10=0,03700, 25=0,02680, 50=0,02020, 100=0,01500, 250=0,01140, 500=0,00912, 1000=0,00672, 5000=0,00482 (USD); RoHS: Yes; Case/Package: 0201; Case Code (Metric): 0603; Case Code (Imperial): 0201; Weight: 6E-06oz; Contact Plating: Tin,Matte; Size Code: 0201; Min Operating Temperature: -55°C; Max Operating Temperature: 125°C; Packaging: Tape and Reel; Resistance: 0R; Package Quantity: 1; Resistor Type: Thick Film; Number of Terminations: 2; Termination: SMD/SMT; Max Power Dissipation: 50mW; Voltage Rating (DC): 25V; Features: Moisture Resistant; Series: RC; Construction: Rectangular; Resistance Tolerance: 5%; Length: 0.024inch; Width: 0.012inch; Height: 0.01inch; Depth: 0.3mm; Radiation Hardening: No; Military Standard: Not; Lead Free: Lead Free; RoHS Compliant: Yes; ComponentLink2URL: https://datasheet.ciiva.com/7672/1563626-7672248.pdf?src-supplier=Element14; ComponentLink2Description: https://datasheet.ciiva.com/7672/1563626-7672248.pdf?src-supplier=Element14; ComponentLink3URL: https://datasheet.ciiva.com/7672/1563626-7672247.pdf?src-supplier=Element14; ComponentLink3Description: https://datasheet.ciiva.com/7672/1563626-7672247.pdf?src-supplier=Element14; ComponentLink4URL: https://datasheet.ciiva.com/7660/1421516-7660808.pdf?src-supplier=Element14; ComponentLink4Description: https://datasheet.ciiva.com/7660/1421516-7660808.pdf?src-supplier=Element14; ComponentLink5URL: https://datasheet.ciiva.com/46391/1421516-46391340.pdf?src-supplier=Element14; ComponentLink5Description: https://datasheet.ciiva.com/46391/1421516-46391340.pdf?src-supplier=Element14
R155 R157 R161 R177 R178 = Res_0402: Manufacturer: Yageo; Manufacturer Part Number 1: RC0201FR-0710KL; Part Description: 10 kOhms ±1% 0.05W, 1/20W Chip Resistor 0201 (0603 Metric) Moisture Resistant Thick Film; Resistance: 10kR; Power Rating: 50mW; Voltage Rating: 25V; Temperature Coefficient: 200ppm/°C; Value: 10k, 1%; ComponentLink1URL: https://datasheet.ciiva.com/5924/1563626-5924912.pdf?src-supplier=Farnell; ComponentLink1Description: https://datasheet.ciiva.com/5924/1563626-5924912.pdf?src-supplier=Farnell; ComponentLink2URL: https://datasheet.ciiva.com/22661/1563626-22661319.pdf?src-supplier=Element14; ComponentLink2Description: https://datasheet.ciiva.com/22661/1563626-22661319.pdf?src-supplier=Element14; Supplier 1: Digi-Key; Supplier Part Number 1: 311-10.0KMCT-ND; Stock 1: 17142315; Pricing 1: 1=0,10000, 10=0,03700, 100=0,01530, 1000=0,00685, 2500=0,00595, 5000=0,00491 (USD); RoHS: Yes; Case/Package: 0201; Number of Pins: 2; Case Code (Imperial): 0201; Case Code (Metric): 0603; Contact Plating: Tin,Matte; Weight: 6E-06oz; Min Operating Temperature: -55°C; Max Operating Temperature: 125°C; Tolerance: 1%; Packaging: Tape and Reel; Package Quantity: 10000; Termination: SMD/SMT; Resistor Type: Thick Film; Number of Terminations: 2; Max Power Dissipation: 50mW; Voltage Rating (DC): 25V; Features: Moisture Resistant; Series: RC; Resistance Tolerance: 1%; Construction: Rectangular; Working Voltage: 25V; Technology: THICK FILM; Length: 0.6mm; Width: 0.012inch; Height: 0.01inch; Depth: 0.3mm; Radiation Hardening: No; Reach SVHC Compliant: Yes; Military Standard: Not; Lead Free: Lead Free; RoHS Compliant: Yes; ComponentLink3URL: https://datasheet.ciiva.com/7660/1421516-7660807.pdf?src-supplier=Element14; ComponentLink3Description: https://datasheet.ciiva.com/7660/1421516-7660807.pdf?src-supplier=Element14; ComponentLink4URL: https://datasheet.ciiva.com/46391/1421516-46391339.pdf?src-supplier=Element14; ComponentLink4Description: https://datasheet.ciiva.com/46391/1421516-46391339.pdf?src-supplier=Element14; ComponentLink5URL: https://datasheet.ciiva.com/2467/pyu-r-int-thick-7-2467110.pdf?src-supplier=Digi-Key; ComponentLink5Description: https://datasheet.ciiva.com/2467/pyu-r-int-thick-7-2467110.pdf?src-supplier=Digi-Key; ComponentLink6URL: https://datasheet.ciiva.com/2467/pyu-r-int-thick-7-2467111.pdf?src-supplier=Digi-Key; ComponentLink6Description: https://datasheet.ciiva.com/2467/pyu-r-int-thick-7-2467111.pdf?src-supplier=Digi-Key; ComponentLink7URL: https://datasheet.ciiva.com/2467/pyu-r-int-thick-7-2467109.pdf?src-supplier=Digi-Key; ComponentLink7Description: https://datasheet.ciiva.com/2467/pyu-r-int-thick-7-2467109.pdf?src-supplier=Digi-Key
R156 = Res_0402: Manufacturer: Yageo; Manufacturer Part Number 1: RC0201FR-07100RL; Part Description: 100 Ohms ±1% 0.05W, 1/20W Chip Resistor 0201 (0603 Metric) Moisture Resistant Thick Film; Power Rating: 50mW; Voltage Rating: 25V; Temperature Coefficient: 200ppm/°C; ComponentLink1URL: http://www.yageo.com/documents/recent/PYu-RC_Group_51_RoHS_L_7.pdf; ComponentLink1Description: http://www.yageo.com/documents/recent/PYu-RC_Group_51_RoHS_L_7.pdf; Value: 100R, 1%; Supplier 1: Digi-Key; Supplier Part Number 1: 311-100MCT-ND; Stock 1: 1625377; Pricing 1: 1=0,10000, 10=0,03700, 100=0,01530, 1000=0,00685, 2500=0,00595, 5000=0,00491 (USD); RoHS: Yes; Case/Package: 0201; Case Code (Metric): 0603; Case Code (Imperial): 0201; Contact Plating: Tin,Matte; Size Code: 0201; Min Operating Temperature: -55°C; Max Operating Temperature: 125°C; Resistance: 100R; Tolerance: 1%; Packaging: Cut Tape; Package Quantity: 1; Resistor Type: Thick Film; Number of Terminations: 2; Termination: SMD/SMT; Max Power Dissipation: 50mW; Features: Moisture Resistant; Series: RC; Resistance Tolerance: 1%; Length: 0.024inch; Width: 0.012inch; Height: 0.01inch; Radiation Hardening: No; Lead Free: Lead Free; RoHS Compliant: Yes; ComponentLink2URL: https://datasheet.ciiva.com/2560/pyu-r-int-thick-7-2560866.pdf?src-supplier=Digi-Key; ComponentLink2Description: https://datasheet.ciiva.com/2560/pyu-r-int-thick-7-2560866.pdf?src-supplier=Digi-Key; ComponentLink3URL: https://datasheet.ciiva.com/2560/pyu-r-int-thick-7-2560867.pdf?src-supplier=Digi-Key; ComponentLink3Description: https://datasheet.ciiva.com/2560/pyu-r-int-thick-7-2560867.pdf?src-supplier=Digi-Key; ComponentLink4URL: https://datasheet.ciiva.com/2560/pyu-r-int-thick-7-2560865.pdf?src-supplier=Digi-Key; ComponentLink4Description: https://datasheet.ciiva.com/2560/pyu-r-int-thick-7-2560865.pdf?src-supplier=Digi-Key; ComponentLink5URL: https://datasheet.ciiva.com/8887/pyu-rc0201-51-rohs-l-8-8887865.pdf?src-supplier=Avnet; ComponentLink5Description: https://datasheet.ciiva.com/8887/pyu-rc0201-51-rohs-l-8-8887865.pdf?src-supplier=Avnet
R163 = Res_0402: Manufacturer: Yageo; Manufacturer Part Number 1: RC0201JR-070RL; Part Description: 0 Ohms Jumper Chip Resistor 0201 (0603 Metric) Moisture Resistant Thick Film; Power Rating: 50mW; Tolerance: 5%; Voltage Rating: 25V; Value: 0R; Supplier 1: Digi-Key; Supplier Part Number 1: 311-0.0NCT-ND; Stock 1: 6252381; Pricing 1: 1=0,10000, 10=0,03700, 25=0,02680, 50=0,02020, 100=0,01500, 250=0,01140, 500=0,00912, 1000=0,00672, 5000=0,00482 (USD); RoHS: Yes; Case/Package: 0201; Case Code (Metric): 0603; Case Code (Imperial): 0201; Contact Plating: Tin,Matte; Min Operating Temperature: -55°C; Max Operating Temperature: 125°C; Package Quantity: 1; Packaging: Tape and Reel; Resistance: 0R; Resistor Type: Thick Film; Number of Terminations: 2; Termination: SMD/SMT; Max Power Dissipation: 50mW; Features: Moisture Resistant; Series: RC; Resistance Tolerance: 5%; Construction: Rectangular; Length: 0.024inch; Width: 0.012inch; Height: 0.01inch; Depth: 0.3mm; Radiation Hardening: No; Military Standard: Not; Lead Free: Lead Free; RoHS Compliant: Yes; ComponentLink1URL: http://www.yageo.com/documents/recent/PYu-RC_Group_51_RoHS_L_7.pdf; ComponentLink1Description: http://www.yageo.com/documents/recent/PYu-RC_Group_51_RoHS_L_7.pdf; ComponentLink2URL: https://datasheet.ciiva.com/7672/1563626-7672248.pdf?src-supplier=Element14; ComponentLink2Description: https://datasheet.ciiva.com/7672/1563626-7672248.pdf?src-supplier=Element14; ComponentLink3URL: https://datasheet.ciiva.com/7672/1563626-7672247.pdf?src-supplier=Element14; ComponentLink3Description: https://datasheet.ciiva.com/7672/1563626-7672247.pdf?src-supplier=Element14; ComponentLink4URL: https://datasheet.ciiva.com/7660/1421516-7660808.pdf?src-supplier=Element14; ComponentLink4Description: https://datasheet.ciiva.com/7660/1421516-7660808.pdf?src-supplier=Element14; ComponentLink5URL: https://datasheet.ciiva.com/46391/1421516-46391340.pdf?src-supplier=Element14; ComponentLink5Description: https://datasheet.ciiva.com/46391/1421516-46391340.pdf?src-supplier=Element14; Size Code: 0201; Voltage Rating (DC): 25V; Weight: 6E-06oz
R164 = Res_0402: Part Description: 3 kOhms ±1% 0.05W, 1/20W Chip Resistor 0201 (0603 Metric) Moisture Resistant Thick Film; Manufacturer: Yageo; Manufacturer Part Number 1: RC0201FR-073KL; Resistance: 3kR; Max Power Dissipation: 50mW; Temperature Coefficient: 200ppm/°C; Value: 3k, 1%; Supplier 1: Digi-Key; Supplier Part Number 1: YAG2656CT-ND; Stock 1: 269780; Pricing 1: 1=0,10000, 10=0,03700, 100=0,01530, 1000=0,00685, 2500=0,00595, 5000=0,00491 (USD); RoHS: Yes; Case/Package: 0201; Case Code (Metric): 0603; Case Code (Imperial): 0201; Min Operating Temperature: -55°C; Max Operating Temperature: 125°C; Packaging: Tape and Reel; Resistor Type: Thick Film; Number of Terminations: 2; Tolerance: 1%; Features: Moisture Resistant; Length: 0.024inch; Width: 0.012inch; Height: 0.01inch; RoHS Compliant: Yes; ComponentLink1URL: http://www.yageo.com/documents/recent/PYu-RC_Group_51_RoHS_L_10.pdf?src-supplier=Digi-Key; ComponentLink1Description: http://www.yageo.com/documents/recent/PYu-RC_Group_51_RoHS_L_10.pdf?src-supplier=Digi-Key; ComponentLink2URL: http://www.yageo.com.tw/exep/pages/download/literatures/PYu-R_INT-thick_7.pdf?src-supplier=Digi-Key; ComponentLink2Description: http://www.yageo.com.tw/exep/pages/download/literatures/PYu-R_INT-thick_7.pdf?src-supplier=Digi-Key; ComponentLink3URL: http://www.yageo.com/documents/recent/PYu-RC_Group_51_RoHS_L_9.pdf?src-supplier=Digi-Key; ComponentLink3Description: http://www.yageo.com/documents/recent/PYu-RC_Group_51_RoHS_L_9.pdf?src-supplier=Digi-Key
R165 = Res_0402: Manufacturer: Yageo; Manufacturer Part Number 1: RC0201FR-0712K7L; Part Description: 12.7 kOhms ±1% 0.05W, 1/20W Chip Resistor 0201 (0603 Metric) Moisture Resistant Thick Film; Resistance: 12.7kR; Temperature Coefficient: 200ppm/°C; Max Power Dissipation: 50mW; Value: 12.7k, 1%; ComponentLink1URL: https://datasheet.ciiva.com/5924/1563626-5924912.pdf?src-supplier=Farnell; ComponentLink1Description: https://datasheet.ciiva.com/5924/1563626-5924912.pdf?src-supplier=Farnell; ComponentLink2URL: https://datasheet.ciiva.com/22661/1563626-22661319.pdf?src-supplier=Element14; ComponentLink2Description: https://datasheet.ciiva.com/22661/1563626-22661319.pdf?src-supplier=Element14; ComponentLink3URL: https://datasheet.ciiva.com/7660/1421516-7660807.pdf?src-supplier=Element14; ComponentLink3Description: https://datasheet.ciiva.com/7660/1421516-7660807.pdf?src-supplier=Element14; ComponentLink4URL: https://datasheet.ciiva.com/46391/1421516-46391339.pdf?src-supplier=Element14; ComponentLink4Description: https://datasheet.ciiva.com/46391/1421516-46391339.pdf?src-supplier=Element14; ComponentLink5URL: https://datasheet.ciiva.com/2467/pyu-r-int-thick-7-2467110.pdf?src-supplier=Digi-Key; ComponentLink5Description: https://datasheet.ciiva.com/2467/pyu-r-int-thick-7-2467110.pdf?src-supplier=Digi-Key; ComponentLink6URL: https://datasheet.ciiva.com/2467/pyu-r-int-thick-7-2467111.pdf?src-supplier=Digi-Key; ComponentLink6Description: https://datasheet.ciiva.com/2467/pyu-r-int-thick-7-2467111.pdf?src-supplier=Digi-Key; ComponentLink7URL: https://datasheet.ciiva.com/2467/pyu-r-int-thick-7-2467109.pdf?src-supplier=Digi-Key; ComponentLink7Description: https://datasheet.ciiva.com/2467/pyu-r-int-thick-7-2467109.pdf?src-supplier=Digi-Key; Supplier 1: Digi-Key; Supplier Part Number 1: 311-12.7KMCT-ND; Stock 1: 49027; Pricing 1: 1=0,10000, 10=0,03700, 100=0,01500, 1000=0,00672, 2500=0,00583, 5000=0,00482 (USD); RoHS: Yes; Case/Package: 0201; Case Code (Metric): 0603; Case Code (Imperial): 0201; Min Operating Temperature: -55°C; Max Operating Temperature: 125°C; Package Quantity: 1; Tolerance: 1%; Packaging: Tape and Reel; Resistor Type: Thick Film; Number of Terminations: 2; Features: Moisture Resistant; Series: RC; Length: 0.024inch; Width: 0.012inch; Height: 0.01inch; RoHS Compliant: Yes; ComponentLink8URL: https://datasheet.ciiva.com/2493/pyu-r-int-thick-7-2493806.pdf?src-supplier=Digi-Key; ComponentLink8Description: https://datasheet.ciiva.com/2493/pyu-r-int-thick-7-2493806.pdf?src-supplier=Digi-Key; ComponentLink9URL: https://datasheet.ciiva.com/2493/pyu-r-int-thick-7-2493807.pdf?src-supplier=Digi-Key; ComponentLink9Description: https://datasheet.ciiva.com/2493/pyu-r-int-thick-7-2493807.pdf?src-supplier=Digi-Key; ComponentLink10URL: https://datasheet.ciiva.com/2493/pyu-r-int-thick-7-2493805.pdf?src-supplier=Digi-Key; ComponentLink10Description: https://datasheet.ciiva.com/2493/pyu-r-int-thick-7-2493805.pdf?src-supplier=Digi-Key
R168 = Res_0402: Manufacturer: Panasonic Electronic Components; Part Description: RES SMD 10 OHM 1% 1/20W 0201; Manufacturer Part Number 1: ERJ-1GEF10R0C; Power (Watts): 0.05W, 1/20W; Resistance (Ohms): 10; Temperature Coefficient: ±200ppm/°C; Value: 10R, 1%; Supplier 1: Digi-Key; Supplier Part Number 1: P10.0ABCT-ND; Package / Case: 0201 (0603 Metric); Height: 0.010" (0.26mm); Supplier Device Package: 0201; Packaging: Cut Tape (CT); Composition: Thick Film; Category: Resistors; Tolerance: ±1%; Number of Terminations: 2; Size / Dimension: 0.024" L x 0.012" W (0.60mm x 0.30mm); Operating Temperature: -55°C ~ 125°C; Features: -; RoHS: RoHS Compliant
R170 = Res_0402: Manufacturer: Yageo; Manufacturer Part Number 1: RC0201FR-071KL; Part Description: 1 kOhms ±1% 0.05W, 1/20W Chip Resistor 0201 (0603 Metric) Moisture Resistant Thick Film; Resistance: 1kR; Power Rating: 50mW; Voltage Rating: 25V; Temperature Coefficient: 200ppm/°C; Value: 1k, 1%; Supplier 1: Digi-Key; Supplier Part Number 1: 311-1KMDKR-ND; Stock 1: 9099863; Pricing 1: 1=0,10000, 10=0,03700, 100=0,01530, 1000=0,00685, 2500=0,00595, 5000=0,00491 (USD); RoHS: Yes; Case/Package: 0201; Case Code (Metric): 0603; Case Code (Imperial): 0201; Contact Plating: Tin,Matte; Min Operating Temperature: -55°C; Max Operating Temperature: 125°C; Package Quantity: 10000; Packaging: Tape and Reel; Tolerance: 1%; Resistor Type: Thick Film; Number of Terminations: 2; Termination: SMD/SMT; Max Power Dissipation: 50mW; Working Voltage: 25V; Features: Moisture Resistant; Series: RC; Resistance Tolerance: 1%; Technology: THICK FILM; Construction: Rectangular; Length: 0.024inch; Width: 0.012inch; Height: 0.01inch; Depth: 0.3mm; Radiation Hardening: No; Military Standard: Not; Lead Free: Lead Free; RoHS Compliant: Yes; ComponentLink1URL: https://datasheet.ciiva.com/7672/1563626-7672204.pdf?src-supplier=Element14; ComponentLink1Description: https://datasheet.ciiva.com/7672/1563626-7672204.pdf?src-supplier=Element14; ComponentLink2URL: https://datasheet.ciiva.com/22698/1563626-22698505.pdf?src-supplier=Element14; ComponentLink2Description: https://datasheet.ciiva.com/22698/1563626-22698505.pdf?src-supplier=Element14; ComponentLink3URL: https://datasheet.ciiva.com/29721/pyu-r-int-thick-7-29721196.pdf?src-supplier=Digi-Key; ComponentLink3Description: https://datasheet.ciiva.com/29721/pyu-r-int-thick-7-29721196.pdf?src-supplier=Digi-Key; ComponentLink4URL: https://datasheet.ciiva.com/29721/pyu-r-int-thick-7-29721195.pdf?src-supplier=Digi-Key; ComponentLink4Description: https://datasheet.ciiva.com/29721/pyu-r-int-thick-7-29721195.pdf?src-supplier=Digi-Key; ComponentLink5URL: https://datasheet.ciiva.com/8896/pyu-rc0201-51-rohs-l-8-8896174.pdf?src-supplier=Avnet; ComponentLink5Description: https://datasheet.ciiva.com/8896/pyu-rc0201-51-rohs-l-8-8896174.pdf?src-supplier=Avnet
R173 = Res_0402: Part Description: 470 Ohms ±1% 0.05W, 1/20W Chip Resistor 0201 (0603 Metric) Moisture Resistant Thick Film; Manufacturer: Yageo; Manufacturer Part Number 1: RC0201FR-07470RL; Voltage Rating (DC): 25V; Value: 470, 1%; ComponentLink1URL: https://datasheet.ciiva.com/8944/crcw0201e3-8944937.pdf?src-supplier=Avnet; ComponentLink1Description: https://datasheet.ciiva.com/8944/crcw0201e3-8944937.pdf?src-supplier=Avnet; ComponentLink2URL: https://datasheet.ciiva.com/2473/crcw0201e3-2473436.pdf?src-supplier=Digi-Key; ComponentLink2Description: https://datasheet.ciiva.com/2473/crcw0201e3-2473436.pdf?src-supplier=Digi-Key; ComponentLink3URL: https://datasheet.ciiva.com/2473/crcw0201e3-2473437.pdf?src-supplier=Digi-Key; ComponentLink3Description: https://datasheet.ciiva.com/2473/crcw0201e3-2473437.pdf?src-supplier=Digi-Key; ComponentLink4URL: https://datasheet.ciiva.com/2473/crcw0201e3-2473438.pdf?src-supplier=Digi-Key; ComponentLink4Description: https://datasheet.ciiva.com/2473/crcw0201e3-2473438.pdf?src-supplier=Digi-Key; ComponentLink5URL: https://datasheet.ciiva.com/16394/dcrcwe3-16394575.pdf?src-supplier=Future+Electronics; ComponentLink5Description: https://datasheet.ciiva.com/16394/dcrcwe3-16394575.pdf?src-supplier=Future+Electronics; Supplier 1: Digi-Key; Supplier Part Number 1: YAG2689CT-ND; Stock 1: 296760; Pricing 1: 1=0,1, 10=0,027, 50=0,0172, 100=0,0143, 500=0,00988, 1000=0,00854, 5000=0,00629 (USD); RoHS: Yes; ComponentLink6URL: https://datasheet.ciiva.com/7672/1563626-7672231.pdf?src-supplier=Element14; ComponentLink6Description: https://datasheet.ciiva.com/7672/1563626-7672231.pdf?src-supplier=Element14; ComponentLink7URL: https://datasheet.ciiva.com/22698/1563626-22698527.pdf?src-supplier=Element14; ComponentLink7Description: https://datasheet.ciiva.com/22698/1563626-22698527.pdf?src-supplier=Element14
R175 R176 R185 R186 = Res_0402: as R122-R129 on sheet 09_Misc; ComponentLink1URL: http://www.yageo.com/documents/recent/PYu-RC_Group_51_RoHS_L_7.pdf; ComponentLink1Description: http://www.yageo.com/documents/recent/PYu-RC_Group_51_RoHS_L_7.pdf; ComponentLink2URL: https://datasheet.ciiva.com/22698/1563626-22698524.pdf?src-supplier=Element14; ComponentLink2Description: https://datasheet.ciiva.com/22698/1563626-22698524.pdf?src-supplier=Element14; ComponentLink3URL: https://datasheet.ciiva.com/14985/pyu-r-int-thick-7-14985418.pdf?src-supplier=Digi-Key; ComponentLink3Description: https://datasheet.ciiva.com/14985/pyu-r-int-thick-7-14985418.pdf?src-supplier=Digi-Key; ComponentLink4URL: https://datasheet.ciiva.com/46391/1421516-46391339.pdf?src-supplier=Element14; ComponentLink4Description: https://datasheet.ciiva.com/46391/1421516-46391339.pdf?src-supplier=Element14; ComponentLink5URL: https://datasheet.ciiva.com/2467/pyu-r-int-thick-7-2467110.pdf?src-supplier=Digi-Key; ComponentLink5Description: https://datasheet.ciiva.com/2467/pyu-r-int-thick-7-2467110.pdf?src-supplier=Digi-Key; ComponentLink6URL: https://datasheet.ciiva.com/2467/pyu-r-int-thick-7-2467111.pdf?src-supplier=Digi-Key; ComponentLink6Description: https://datasheet.ciiva.com/2467/pyu-r-int-thick-7-2467111.pdf?src-supplier=Digi-Key; ComponentLink7URL: https://datasheet.ciiva.com/2467/pyu-r-int-thick-7-2467109.pdf?src-supplier=Digi-Key; ComponentLink7Description: https://datasheet.ciiva.com/2467/pyu-r-int-thick-7-2467109.pdf?src-supplier=Digi-Key; Case/Package: 0201; Case Code (Imperial): 0201; Case Code (Metric): 0603; Construction: Rectangular; Depth: 0.3mm; Features: Moisture Resistant; Height: 0.01inch; Length: 0.024inch; Max Operating Temperature: 125°C; Military Standard: Not; Min Operating Temperature: -55°C; Number of Terminations: 2; Package Quantity: 10000; Packaging: Tape and Reel; Power Rating: 50mW; Pricing 1: 1=0,10000, 10=0,03700, 100=0,01500, 1000=0,00672, 2500=0,00583, 5000=0,00482 (USD); Resistance Tolerance: 1%; Resistor Type: Thick Film; RoHS: Yes; RoHS Compliant: Yes; Series: RC; Stock 1: 586100; Supplier 1: Digi-Key; Supplier Part Number 1: YAG2285CT-ND; Termination: SMD/SMT; Tolerance: 1%; Value: 3k3, 1%; Width: 0.3mm
R179 = Res_0402: Part Description: 330 Ohms ±1% 0.05W, 1/20W Chip Resistor 0201 (0603 Metric) Thick Film; Manufacturer: Vishay Dale; Manufacturer Part Number 1: CRCW0201330RFKED; Power Rating: 50mW; Voltage Rating: 30V; Temperature Coefficient: 100ppm/°C; Value: 330R, 1%; Supplier 1: Digi-Key; Supplier Part Number 1: 541-330AABCT-ND; Stock 1: 245078; Pricing 1: 1=0,27000, 10=0,23000, 100=0,08990, 1000=0,03762, 2500=0,03448, 5000=0,03135 (USD); RoHS: Yes; Case/Package: 0201; Weight: 6E-06oz; Case Code (Imperial): 0201; Case Code (Metric): 0603; Contact Plating: Tin; Size Code: 0201; Min Operating Temperature: -55°C; Max Operating Temperature: 155°C; Resistance: 330R; Tolerance: 1%; Packaging: Tape and Reel; Package Quantity: 1; Resistor Type: Thick Film; Number of Terminations: 2; Max Power Dissipation: 50mW; Series: CRCW; Construction: Rectangular; Length: 0.6mm; Width: 0.3mm; Height: 0.011inch; Depth: 0.3mm; Radiation Hardening: No; Military Standard: Not; Lead Free: Lead Free; RoHS Compliant: Yes; ComponentLink1URL: https://datasheet.ciiva.com/8944/crcw0201e3-8944937.pdf?src-supplier=Avnet; ComponentLink1Description: https://datasheet.ciiva.com/8944/crcw0201e3-8944937.pdf?src-supplier=Avnet; ComponentLink2URL: https://datasheet.ciiva.com/2473/crcw0201e3-2473436.pdf?src-supplier=Digi-Key; ComponentLink2Description: https://datasheet.ciiva.com/2473/crcw0201e3-2473436.pdf?src-supplier=Digi-Key; ComponentLink3URL: https://datasheet.ciiva.com/2473/crcw0201e3-2473437.pdf?src-supplier=Digi-Key; ComponentLink3Description: https://datasheet.ciiva.com/2473/crcw0201e3-2473437.pdf?src-supplier=Digi-Key; ComponentLink4URL: https://datasheet.ciiva.com/2473/crcw0201e3-2473438.pdf?src-supplier=Digi-Key; ComponentLink4Description: https://datasheet.ciiva.com/2473/crcw0201e3-2473438.pdf?src-supplier=Digi-Key; ComponentLink5URL: https://datasheet.ciiva.com/16394/dcrcwe3-16394575.pdf?src-supplier=Future+Electronics; ComponentLink5Description: https://datasheet.ciiva.com/16394/dcrcwe3-16394575.pdf?src-supplier=Future+Electronics
TP7 TP8 = TESTPOINT_PAD: Test Point PCB mount Miniature White
VT1 VT2 = DMG1012T: Manufacturer: Diodes Incorporated; Manufacturer Part Number 1: DMG1012TQ-7; Part Description: N-Channel 20V 630mA (Ta) 280mW (Ta) Surface Mount SOT-523; FET Type: N-Channel; Current - Continuous Drain (Id) @ 25°C: 630mA (Ta); Drive Voltage (Max Rds On,  Min Rds On): 1.8V, 4.5V; Rds On (Max) @ Id, Vgs: 400 mOhm @ 600mA, 4.5V; Vgs(th) (Max) @ Id: 1V @ 250µA; Vgs (Max): ±6V; Power Dissipation (Max): 280mW (Ta); Supplier 1: Digi-Key; RoHS: RoHS Compliant; Category: Discrete Semiconductor Products; Stock 1: 3569; Pricing 1: 1=0.47, 10=0.424, 100=0.2375, 500=0.12722, 1000=0.08651 (USD); Packaging: Cut Tape (CT); Part Status: Active; Technology: MOSFET (Metal Oxide); FET Feature: -; Operating Temperature: -55°C ~ 150°C (TJ); Mounting Type: Surface Mount; Supplier Device Package: SOT-523; Package / Case: SOT-523; ComponentLink1URL: https://www.diodes.com/assets/Datasheets/ds31783.pdf; ComponentLink1Description: https://www.diodes.com/assets/Datasheets/ds31783.pdf; Supplier Part Number 1: DMG1012TQ-7DICT-ND
XO1 = RPT7050A: Part Description: TCXO 30.72MHz, E6245LF; Manufacturer: Rakon; Manufacturer Part Number 1: E6245LF; Supplier 1: Rakon; Supplier Part Number 1: E6245LF
XO2 = TXCO: Part Description: TCXO 30.72MHz, E5280LF; Manufacturer: Rakon; Manufacturer Part Number 1: E5280LF; Supplier 1: Rakon; Supplier Part Number 1: E5280LF

## Sheet 11_Power.SchDoc: Power
size A3; Organization: Lime Microsystems; Address1: Surrey Tech Centre; Address2: Guildford GU2 7YG; Address3: Surrey; Address4: United Kingdom; Revision: 1.3; SheetNumber: 11; SheetTotal: 11
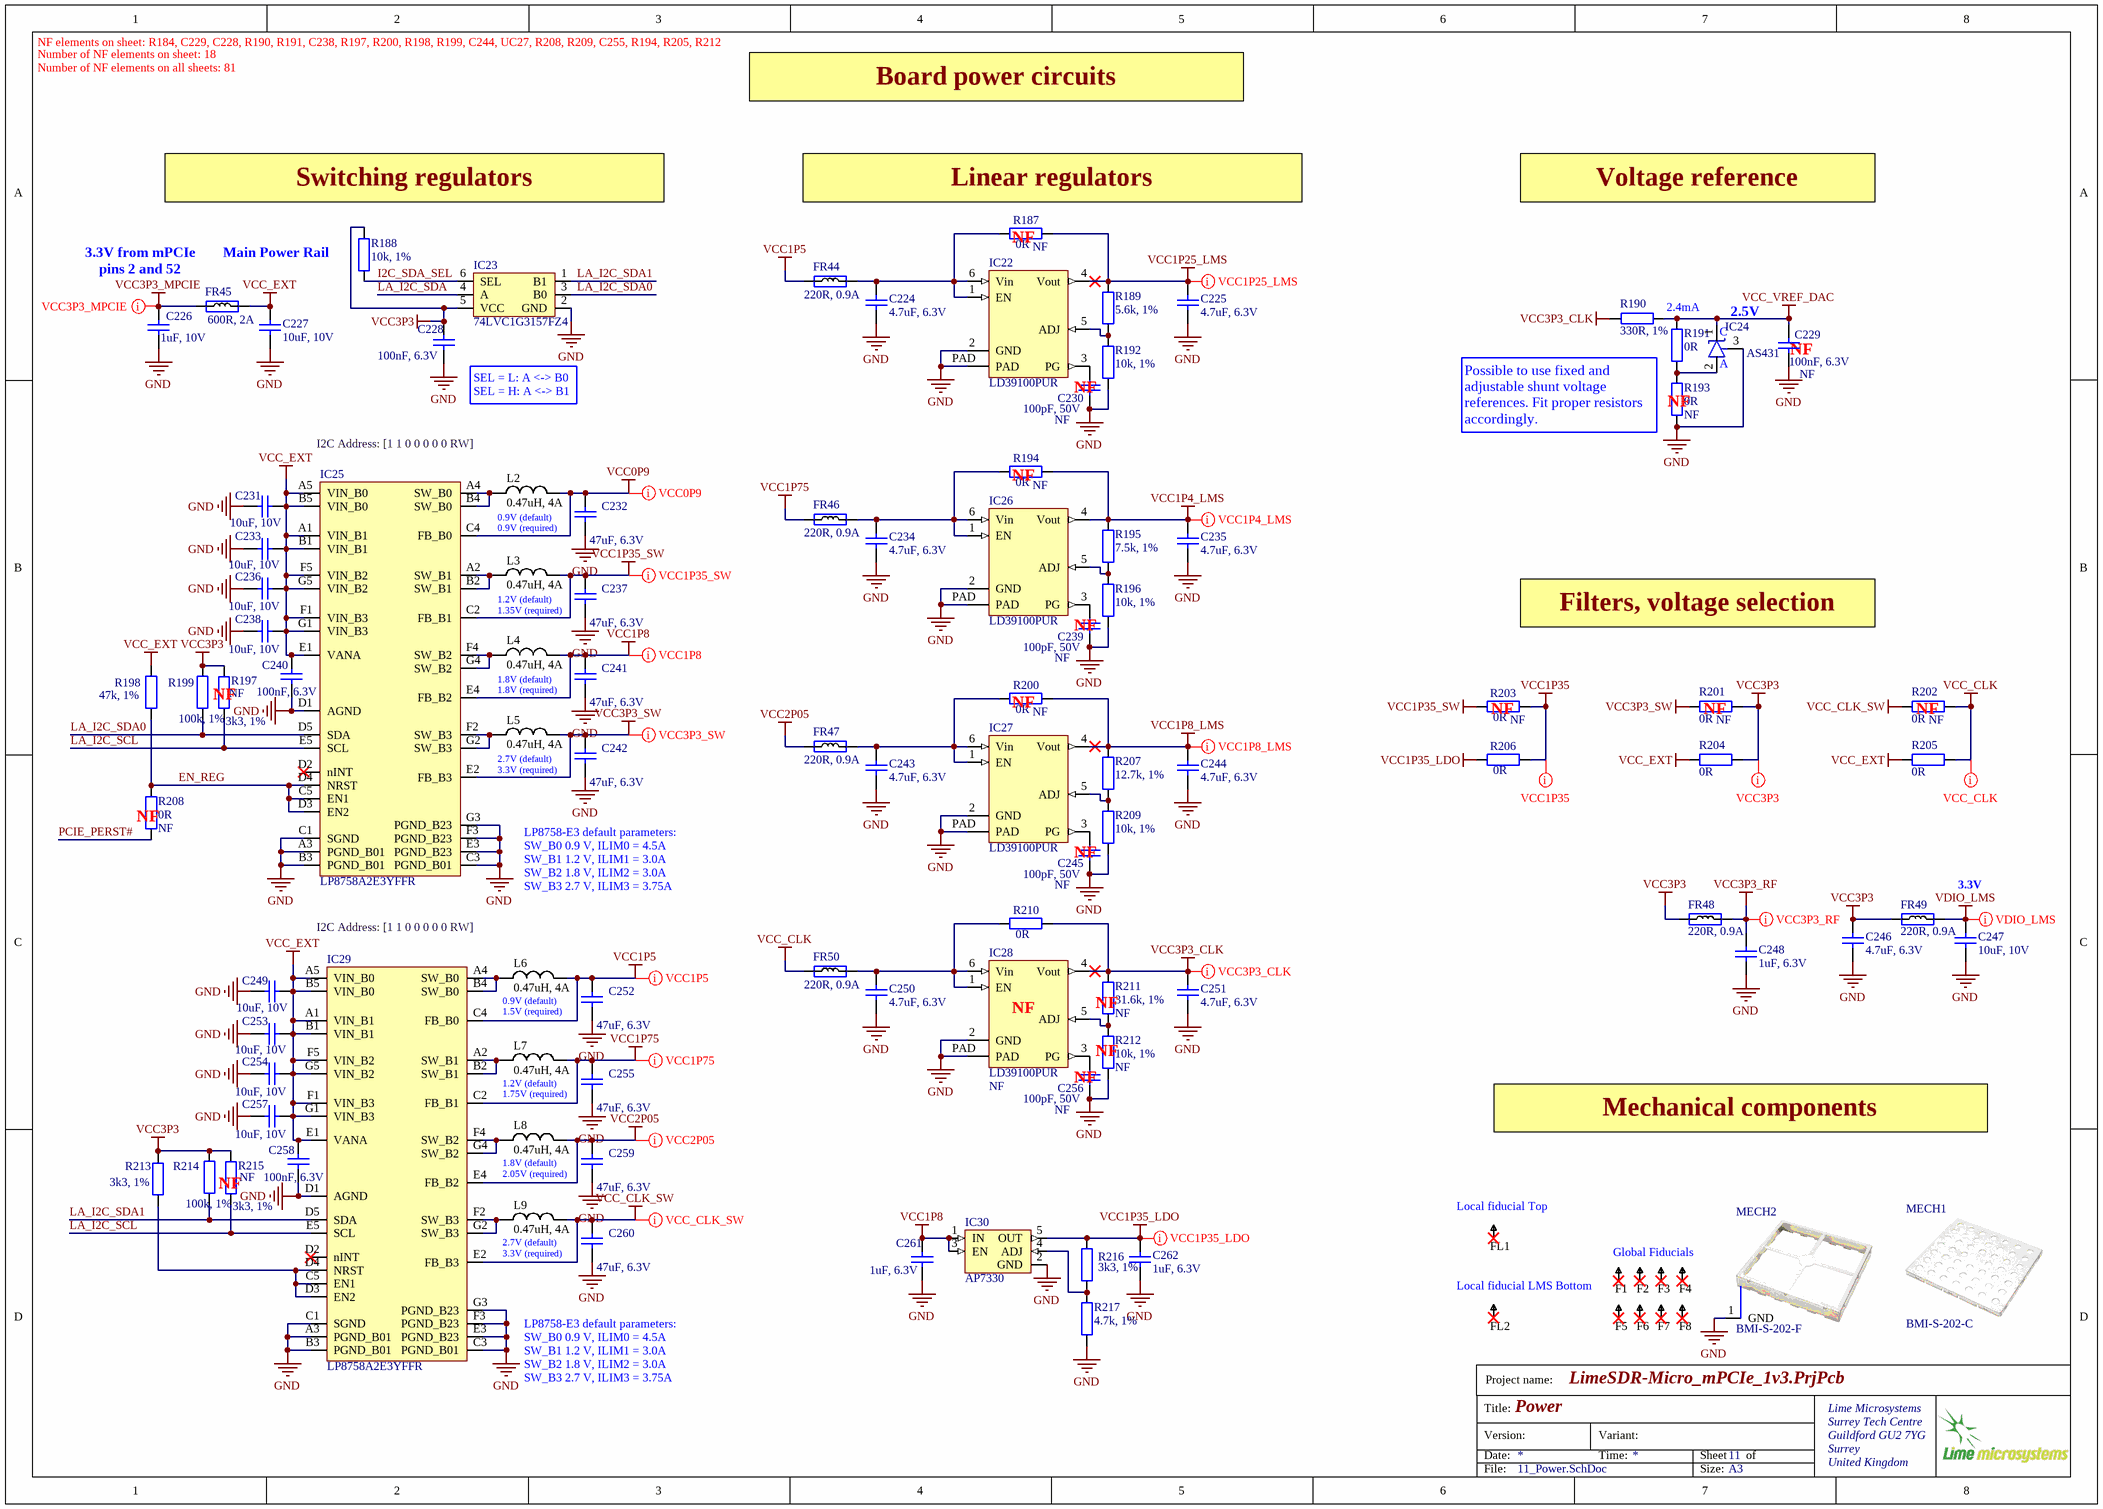
[diagram p10: 11_Power.SchDoc]